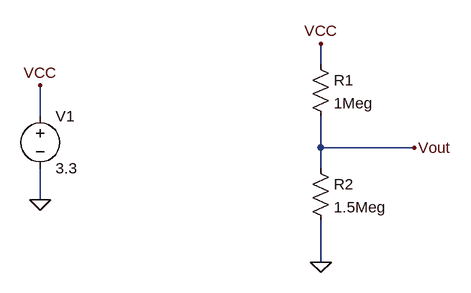
[diagram p0: schematic Draft1.asc]
Draft1.asc, the LTspice schematic file:
Version 4
SHEET 1 880 680
WIRE 576 0 576 -32
WIRE 144 80 144 32
WIRE 576 128 576 80
WIRE 720 128 576 128
WIRE 576 160 576 128
WIRE 144 208 144 160
WIRE 576 304 576 240
FLAG 144 208 0
FLAG 144 32 VCC
FLAG 576 304 0
FLAG 576 -32 VCC
FLAG 720 128 Vout
SYMBOL voltage 144 64 R0
WINDOW 123 0 0 Left 0
WINDOW 39 0 0 Left 0
SYMATTR InstName V1
SYMATTR Value 3.3
SYMBOL res 560 -16 R0
SYMATTR InstName R1
SYMATTR Value 1Meg
SYMBOL res 560 144 R0
SYMATTR InstName R2
SYMATTR Value 1.5Meg

The netlist it stands for:
* Draft1.asc
V1 VCC 0 3.3
R1 VCC Vout 1Meg
R2 Vout 0 1.5Meg
.backanno
.end